# EasyEDA schematic 4.54.json
TITLE: Sheet_1; REV: 1.0; Date: 2020-11-18; Sheet: 1/1; Drawn By: Gökbey Keskin; Company: Your Company
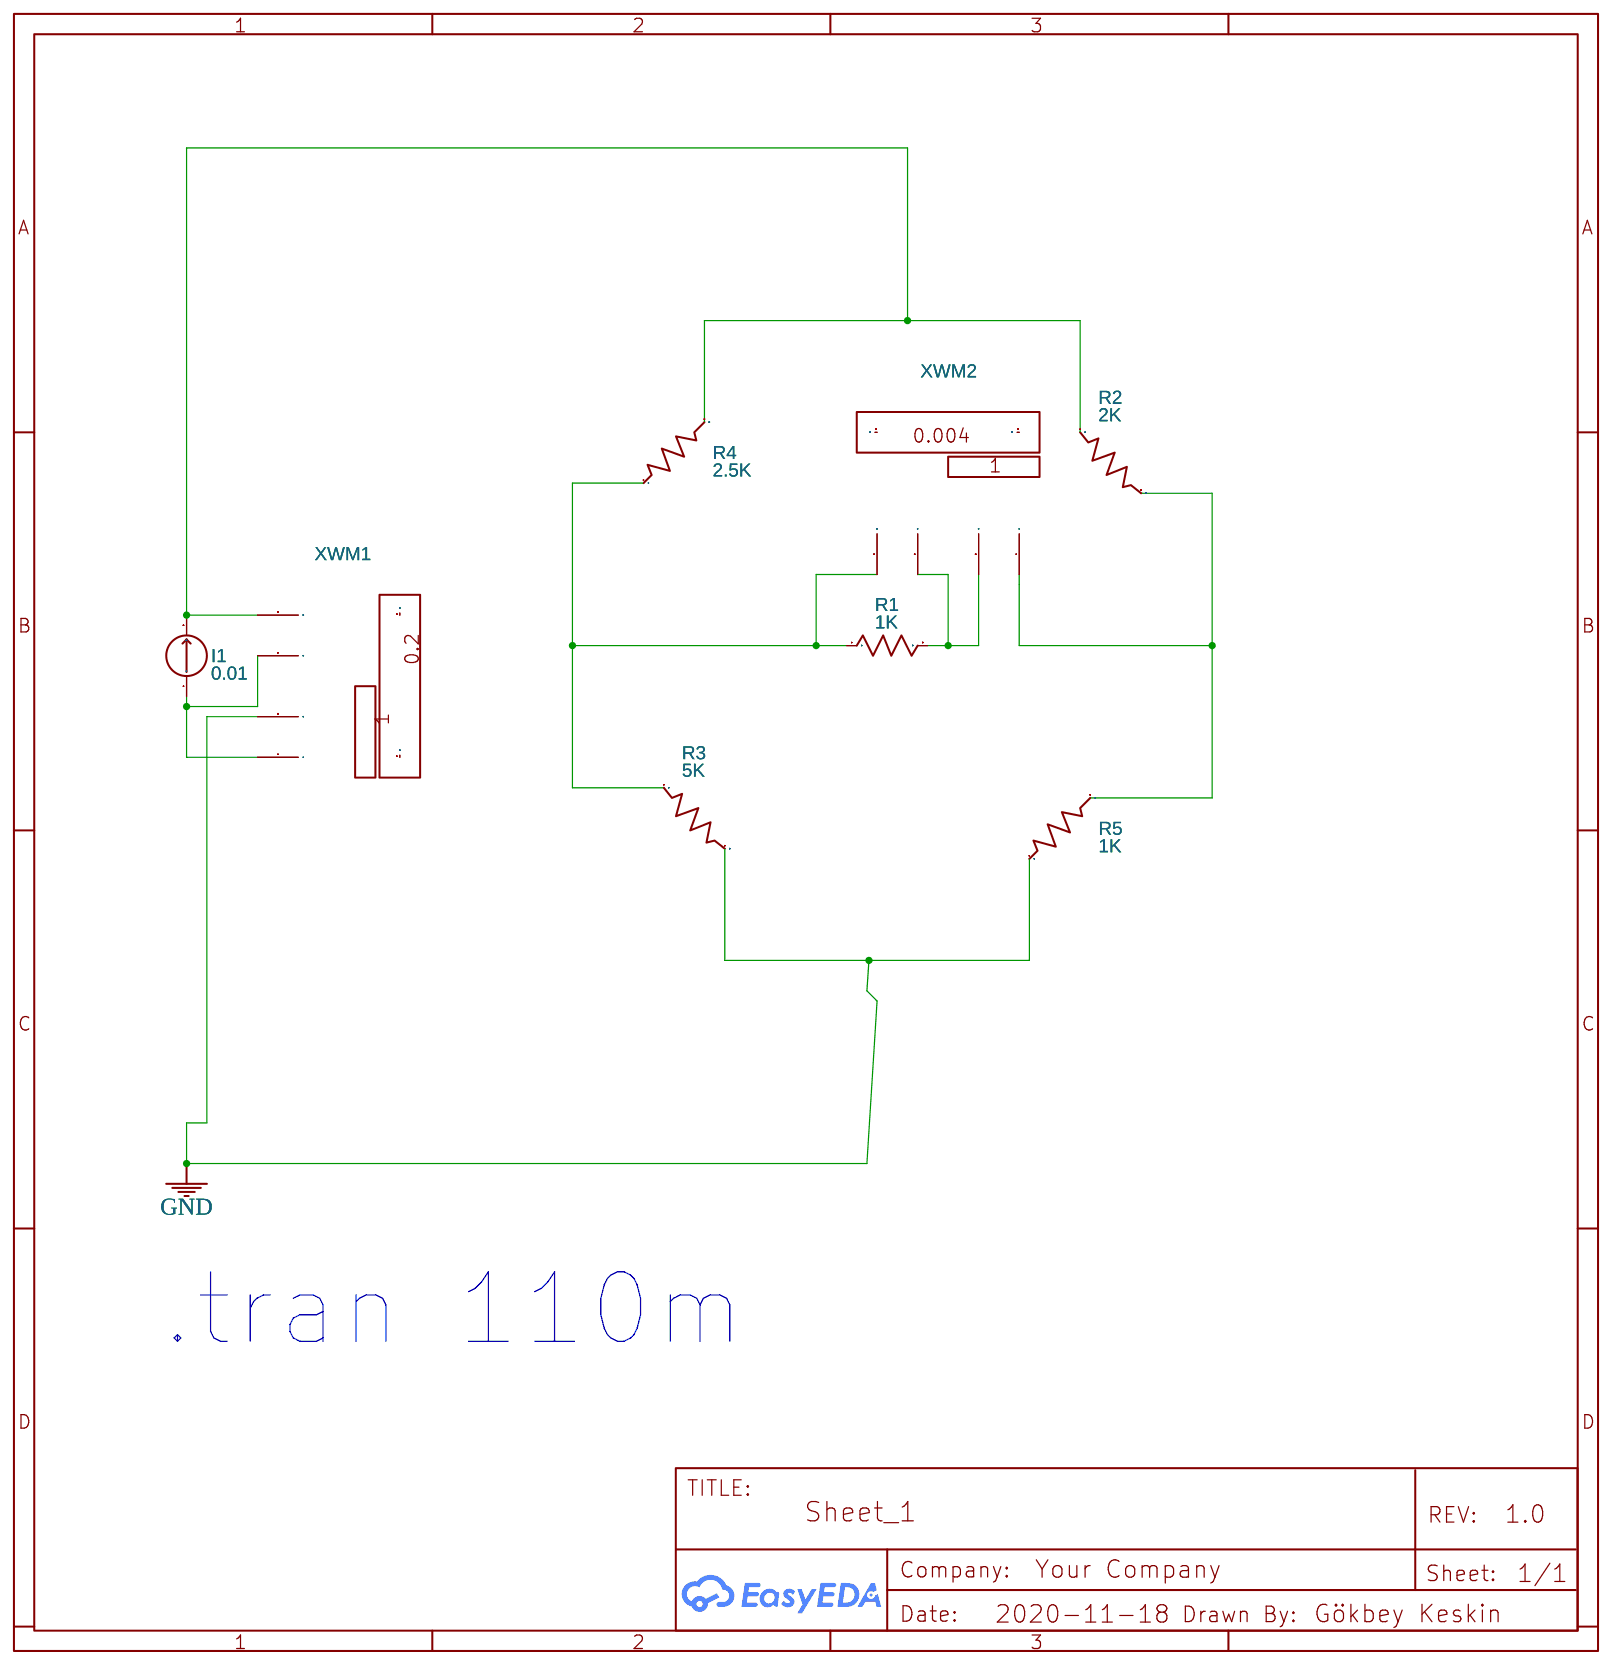
[diagram p0: schematic sheet]

## Parts
I1  0.01  [2P-5.08]
R1  1K  [AXIAL-0.3]
R2  2K  [AXIAL-0.3]
R3  5K  [AXIAL-0.3]
R4  2.5K  [AXIAL-0.3]
R5  1K  [AXIAL-0.3]
XWM1  Wattmeter
XWM2  Wattmeter

## Library data of the parts
I1 = IDC: Contributor: EasyEDA; sim: true
R1 = Resistor_US: Resistance: 1k; Contributor: EasyEDA; Supplier: YUJING
R2-R4 = Resistor_45Degree_US: Supplier: YUJING; Contributor: EasyEDA; Resistance: 1K
R5 = Resistor_45Degree_US: Supplier: YUJING; Contributor: EasyEDA
XWM1 XWM2 = WATTMETER: Contributor: EasyEDA; NameDisplay: 0; sim: true

## Nets
GND: R3.2 R5.1 XWM1.3(I+)
Net-(I1-1): I1.1 XWM1.2(V-) XWM1.4(I-)
Net-(I1-2): I1.2 R2.1 R4.2 XWM1.1(V+)
Net-(R1-1): R1.1 R3.1 R4.1 XWM2.1(V+)
Net-(R1-2): R1.2 XWM2.2(V-) XWM2.3(I+)
Net-(R2-2): R2.2 R5.2 XWM2.4(I-)

Not connected (* = marked no-connect by the designer): XWM1 P PF; XWM2 P PF

## Notes on the sheet
- .tran 110m
